# EAGLE design ProFinal (EAGLE 6.3)
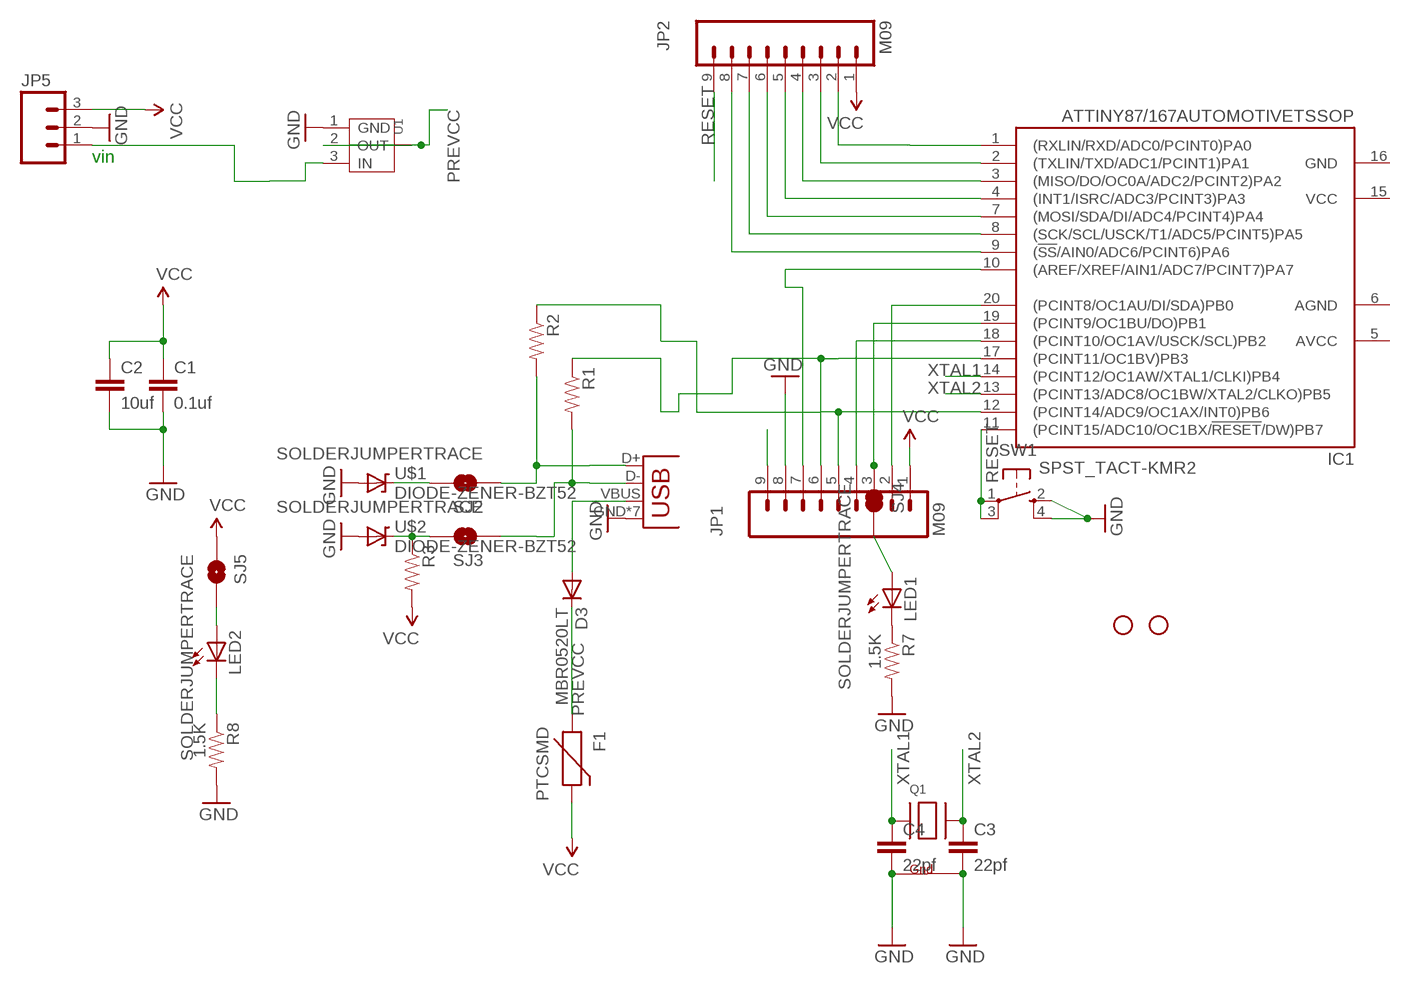
[diagram p0: schematic, sheet 1]

## Parts
C1  0.1uf  CAP0603-CAP  [0603-CAP]
C2  10uf  CAP0805  [0805]
C3  22pf  CAP0603-CAP  [0603-CAP]
C4  22pf  CAP0603-CAP  [0603-CAP]
D3  MBR0520LT  [SOD123]
F1  PTCSMD  [PTC-1206]
IC1  ATTINY87/167AUTOMOTIVETSSOP  [TSSOP20]
JP1  M09  [1X09]
JP2  M09  [1X09]
JP5  M03PTH  [1X03]
LED1  LEDCHIP-LED0805  [CHIP-LED0805]
LED2  LEDCHIP-LED0805  [CHIP-LED0805]
Q1  XTAL-4-3225  [NX3225]
R1  RESISTOR0603-RES  [0603-RES]
R2  RESISTOR0603-RES  [0603-RES]
R3  RESISTOR0603-RES  [0603-RES]
R7  1.5K  RESISTOR0603-RES  [0603-RES]
R8  1.5K  RESISTOR0603-RES  [0603-RES]
SJ2  SOLDERJUMPERTRACE  [SJ_2S-TRACE]
SJ3  SOLDERJUMPERTRACE  [SJ_2S-TRACE]
SJ4  SOLDERJUMPERTRACE  [SJ_2S-TRACE]
SJ5  SOLDERJUMPERTRACE  [SJ_2S-TRACE]
STANDOFF3  STAND-OFFTIGHT  [STAND-OFF-TIGHT]
STANDOFF4  STAND-OFFTIGHT  [STAND-OFF-TIGHT]
SW1  SPST_TACT-KMR2  [KMR2]
U1  LD1117SOT89  [SOT89]
U$1  DIODE-ZENER-BZT52  [SOD-323]
U$2  DIODE-ZENER-BZT52  [SOD-323]
X1  USB-MICROB  [USB-MICROB]

## Nets
GND [POWER]: C1.2 C2.2 C3.2 C4.2 JP1.8 JP5.2 Q1.2(G2) Q1.4(G1) R7.2 R8.2 SW1.2(S) SW1.4(S1) U1.1(GND) U$1.2(A) U$2.2(A) X1.GND X1.P1(GND) X1.P2(GND) X1.P3(GND) X1.P4(GND) X1.P5(GND) X1.P6(GND)
N$1: IC1.20((PCINT8/OC1AU/DI/SDA)PB0) JP1.2
N$2: IC1.12((PCINT14/ADC9/OC1AX/INT0)PB6) JP1.5 R2.1
N$3: IC1.19((PCINT9/OC1BU/DO)PB1) JP1.3 SJ4.1
N$4: IC1.1((RXLIN/RXD/ADC0/PCINT0)PA0) JP2.2
N$5: IC1.2((TXLIN/TXD/ADC1/PCINT1)PA1) JP2.3
N$6: IC1.3((MISO/DO/OC0A/ADC2/PCINT2)PA2) JP2.4
N$7: IC1.4((INT1/ISRC/ADC3/PCINT3)PA3) JP2.5
N$8: IC1.7((MOSI/SDA/DI/ADC4/PCINT4)PA4) JP2.6
N$10: IC1.18((PCINT10/OC1AV/USCK/SCL)PB2) JP1.4
N$12: R1.2 SJ3.1 X1.D-
N$13: R2.2 SJ2.1 X1.D+
N$14: IC1.8((SCK/SCL/USCK/T1/ADC5/PCINT5)PA5) JP2.7
N$15: IC1.9((!SS!/AIN0/ADC6/PCINT6)PA6) JP2.8
N$16: IC1.10((AREF/XREF/AIN1/ADC7/PCINT7)PA7) JP1.7
N$18: IC1.17((PCINT11/OC1BV)PB3) JP1.6 R1.1
N$19: SJ2.2 U$1.1(C)
N$20: R3.1 SJ3.2 U$2.1(C)
N$21: LED1.C R7.1
N$22: LED1.A SJ4.2
N$23: LED2.A SJ5.2
N$24: LED2.C R8.1
N$25 [POWER]: D3.A X1.VBUS
PREVCC [POWER]: D3.C F1.1 U1.2(OUT) U1.4(TAB)
RESET: IC1.11((PCINT15/ADC10/OC1BX/!RESET!/DW)PB7) JP2.9 SW1.1(P) SW1.3(P1)
VCC [POWER]: C1.1 C2.1 F1.2 JP1.1 JP2.1 JP5.3 R3.2 SJ5.1
VIN [POWER]: JP1.9 JP5.1 U1.3(IN)
XTAL1: C4.1 IC1.14((PCINT12/OC1AW/XTAL1/CLKI)PB4) Q1.1(X1)
XTAL2: C3.1 IC1.13((PCINT13/ADC8/OC1BW/XTAL2/CLKO)PB5) Q1.3(X2)
Unconnected: IC1.5(AVCC) IC1.6(AGND)

## Notes on the sheet
- vin

## Power pins joined to a net without a drawn wire
GND: IC1.16(GND)
VCC: IC1.15(VCC)

## Library data of the parts
C1-C4 = SparkFun:CAP: Capacitor Standard 0603 ceramic capacitor, and 0.1" leaded capacitor.
D3 = diode:MBR0520LT: SCHOTTKY BARRIER RECTIFIER Source: http://onsemi.com .. MBR0520LT1-D.pdf
F1 = SparkFun-PowerIC:PTC: Resettable Fuse PTC Resettable Fuse. Spark Fun Electronics SKU : COM-08357
IC1 = attiny87_167_automotive:ATTINY87/167AUTOMOTIVE
JP1 JP2 = SparkFun:M09: Header 9 Standard 9-pin 0.1" header. Use with straight break away headers (SKU : PRT-00116), right angle break away headers (PRT-00553), swiss pins (PRT-00743), machine pins (PRT-00117), and female headers (PRT-00115).
JP5 = SparkFun:M03: Header 3 Standard 3-pin 0.1" header. Use with straight break away headers (SKU : PRT-00116), right angle break away headers (PRT-00553), swiss pins (PRT-00743), machine pins (PRT-00117), and female headers (PRT-00115). Molex polarized connector foot print use with SKU : PRT-08232 with associated crimp pins and housings.
LED1 LED2 = adafruit:LED: LED OSRAM: - CHIPLED LG R971, LG N971, LY N971, LG Q971, LY Q971, LO R971, LY R971 LH N974, LH R974 LS Q976, LO Q976, LY Q976 LO Q996 - Hyper CHIPLED LW Q18S LB Q993, LB Q99A, LB R99A - SideLED LS A670, LO A670, LY A670, LG A670, LP A670 LB A673, LV A673, LT A673, LW A673 LH A674 LY A675 LS A676, LA A676, LO A676, LY A676, LW A676 LS A679, LY A679, LG A679 - Hyper Micro SIDELED® LS Y876, LA Y876, LO Y876, LY Y876 LT Y87S - SmartLED LW L88C, LW L88S LB L89C, LB L89S, LG L890 LS L89K, LO L89K, LY L89K LS L896, LA L896, LO L896, LY L896 - TOPLED LS T670, LO T670, LY T670, LG T670, LP T670 LSG T670, LSP T670, LSY T670, LOP T670, LYG T670 LG T671, LOG T671, LSG T671 LB T673, LV T673, LT T673, LW T673 LH T674 LS T676, LA T676, LO T676, LY T676, LB T676, LH T676, LSB T676, LW T676 LB T67C, LV T67C, LT T67C, LS T67K, LO T67K, LY T67K, LW E67C LS E67B, LA E67B, LO E67B, LY E67B, LB E67C, LV E67C, LT E67C LW T67C LS T679, LY T679, LG T679 LS T770, LO T770, LY T770, LG T770, LP T770 LB T773, LV T773, LT T773, LW T773 LH T774 LS E675, LA E675, LY E675, LS T675 LS T776, LA T776, LO T776, LY T776, LB T776 LHGB T686 LT T68C, LB T68C - Hyper Mini TOPLED® LB M676 - Mini TOPLED Santana® LG M470 LS M47K, LO M47K, LY M47K Source: http://www.osram.convergy.de/
Q1 = adafruit:XTAL-4: Classic 4-pin 3.2 x 2.5mm crystal
R1-R3 R7 R8 = SparkFun-Passives:RESISTOR: Resistor Basic schematic elements and footprints for 0603, 1206, and PTH resistors.
SJ2-SJ5 = SparkFun:SOLDERJUMPER: Solder Jumper Standard SMD solder jumper. Used to automate production. Two varients : Normally Open and Normally Closed are the same, but have different paste layers. NC will have a large amount of paste and should jumper during reflow.
STANDOFF3 STANDOFF4 = holes:STAND-OFF: #4 Stand Off This is the mechanical footprint for a #4 phillips button head screw. Use the keepout ring to avoid running the screw head into surrounding components. SKU : PRT-00447
SW1 = adafruit:SPST_TACT: SMT 6mm switch, EVQQ2 series http://www.ladyada.net/library/eagle
U1 = IC:LD1117
U$1 U$2 = SparkFun-DiscreteSemi:DIODE-ZENER: Zener Diode Production Part - 8199 3.4V Zener Voltage
X1 = embeddedmicro:USB: USB Connectors USB-B-PTH is fully proven SKU : PRT-00139/CONN-08278 USB-miniB is fully proven SKU : PRT-00587 USB-A-PCB is untested. USB-A-H is throughly reviewed, but untested. Spark Fun Electronics SKU : PRT-00437 USB-B-SMT is throughly reviewed, but untested. Needs silkscreen touching up. USB-A-S has not been used/tested USB-MB-H has not been used/tested USB-MICROB has been used. CONN-09505; PROD_ID: CONN-09505

## Net classes
1 POWER: width 0.203 mm

## Board
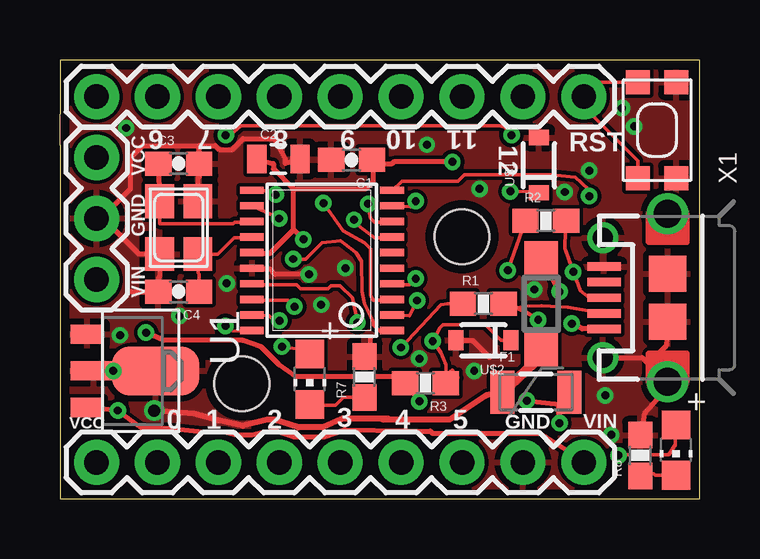
[diagram p1: board, top side]
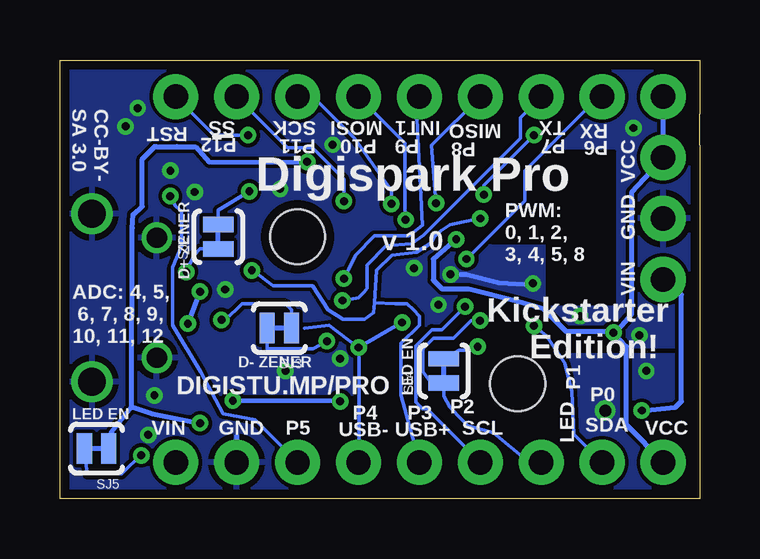
[diagram p2: board, bottom side, seen from below]

Size 26.67 x 18.29 mm. Coordinates in mm from the lower left corner, seen from the top.
Outline: 0,14.73 0,16.03 0,18.29 26.67,18.29 26.67,0 0,0 0,4.29 0,10.41 0,14.73
Copper layers (1*16): Top 0.0356mm / dielectric 1.5011mm / Bottom 0.0356mm
Design rules "LaenPCBOrder *": minimum track width 6mil, minimum drill 13mil, track to track 6mil, track to pad 6mil, pad to pad 6mil, via to via 6mil, smd to smd 6mil, copper to edge 15mil, drill to drill 6mil, minimum pad ring 7mil, minimum via ring 7mil, stop-mask expansion 4mil, vias tented up to drill 20mil, thermal gap 10mil
tRestrict: area 0.3,5.8 to 2,6.1
bRestrict: area 3.6,8.1 to 8.6,14.5

### Footprints (pad centres in the part's own frame; a part is rotated, then mirrored left to right if it is on the bottom)
0603-CAP = smd 1.1 x 1: 1 -0.85,0; 2 0.85,0
0805 = smd 0.8 x 1.2: 1 -0.9,0; 2 0.9,0
SOD123 = smd 1.4 x 1.4: A 1.9,0; C -1.9,0
PTC-1206 = smd 1 x 1.8: 1 -1.4,0; 2 1.4,0
TSSOP20 = smd 0.305 x 0.991: 1 -2.925,-2.918; 2 -2.275,-2.918; 3 -1.625,-2.918; 4 -0.975,-2.918; 5 -0.325,-2.918; 6 0.325,-2.918; 7 0.975,-2.918; 8 1.625,-2.918; 9 2.275,-2.918; 10 2.925,-2.918; 11 2.925,2.918; 12 2.275,2.918; 13 1.625,2.918; 14 0.975,2.918; 15 0.325,2.918; 16 -0.325,2.918; 17 -0.975,2.918; 18 -1.625,2.918; 19 -2.275,2.918; 20 -2.925,2.918
1X09 = drill 1.016 pad 1.88: 1 0,0; 2 2.54,0; 3 5.08,0; 4 7.62,0; 5 10.16,0; 6 12.7,0; 7 15.24,0; 8 17.78,0; 9 20.32,0
1X03 = drill 1.016 pad 1.88: 1 0,0; 2 2.54,0; 3 5.08,0
CHIP-LED0805 = smd 1.2 x 1.2: A 0,-1.05; C 0,1.05
NX3225 = smd 1.4 x 1.2: 1 -1.1,-0.8; 2 1.1,-0.8; 3 1.1,0.8; 4 -1.1,0.8
0603-RES = smd 1.1 x 1: 1 -0.85,0; 2 0.85,0
SJ_2S-TRACE = smd 0.635 x 1.27: 1 -0.508,0; 2 0.508,0
STAND-OFF-TIGHT = hole 2.286: 0,0
KMR2 = smd 1 x 1: 1 2,0.8; 2 2,-0.8; 3 -2,0.8; 4 -2,-0.8
SOT89 = smd 0.8 x 1.4: 1 -1.524,-1.905; 3 1.524,-1.905 | smd 0.8 x 1.9: 2 0,-1.651 | smd 2.032 x 3.65: 4 0,0.94
SOD-323 = smd 0.63 x 0.83: 1 -1.15,0; 2 1.15,0
USB-MICROB = smd 0.35 x 1.4: D+ 0,2.65; D- -0.65,2.65; GND 1.3,2.65; ID 0.65,2.65; VBUS -1.3,2.65 | smd 1.5 x 1.55: P1 -1,0; P2 1,0 | drill 1.15 pad 1.422: P3 -3.5,0; P4 3.5,0 | drill 0.85 pad 1.27: P5 -2.5,2.7; P6 2.5,2.7

### Placement (x,y rotation side)
C1  12.16,14.13 180 top
C2  9.11,14.16 0 top
C3  4.95,13.97 0 top
C4  4.95,8.64 180 top
D3  20.07,8.13 90 top
F1  19.84,4.45 0 top
IC1  10.92,9.94 90 top
JP1  1.52,1.52 0 top
JP2  1.52,16.76 0 top
JP5  1.52,9.14 90 top
LED1  10.41,4.98 180 top
LED2  25.69,2.03 180 top
Q1  4.95,11.3 90 top
R1  17.65,8.13 0 top
R2  20.26,11.59 0 top
R3  15.24,4.83 180 top
R7  12.7,5.08 90 top
R8  24.19,1.81 90 top
SJ2  20.07,10.92 90 bottom
SJ3  17.53,7.11 180 bottom
SJ4  10.67,5.33 90 bottom
SJ5  25.15,2.1 180 bottom
STANDOFF3  7.59,4.79 0 top
STANDOFF4  16.76,10.92 0 top
SW1  24.89,15.37 90 top
U1  3.05,5.33 270 top
U$1  19.97,13.91 90 top
U$2  17.65,6.6 180 top
X1  25.34,8.38 90 top

### Tracks (layer width: path | path; a pad name or v marks a point on that pad's centre or on a via)
GND  (via drill 0.33, 0.33 pad 0.69)
  Top 0.203: 5.8,14.72 6.48,14.72 6.64,14.56 7.17,14.56 7.63,15.02 8.94,15.02 9.39,14.19 9.39,13.97 C2.2 | v10.38,9.36 8.97,9.36 8.75,9.58 8.38,9.58 8,9.58 | 2.99,8.64 C4.2 4.1,9.2 4.15,9.25 Q1.4 3.3,10.2 1.76,11.74 | 1.76,11.74 2.95,12.92 2.95,14.22 3.45,14.72 5.8,14.72 | 17.92,5.88 17.2,6.6 16.63,6.6 U$2.2 | 24.52,5.63 25.27,4.88 25.27,4.58 24.38,3.56 24.26,2.76 R8.2 | 22.57,5.88 24.27,5.88 24.52,5.63 | 24.52,5.63 25.27,6.38 X1.P1 | 12.95,5.93 12.95,6.73 | JP5.2 1.71,11.68 1.76,11.74 | 5.8,14.72 C3.2 5.8,13.41 5.75,13.36 Q1.2
  Bottom 0.203: v10.38,9.36 9.73,9.36 8.36,9 6.96,8.92 | 19.3,2.61 JP1.8
  other vias: 17.27,5.33 10.89,8.09 11.9,9.61 6.95,8.98 2.51,6.82 2.76,15.46 21.05,12.79 22.73,4.32 22.06,13.68 4.98,7.61 14.99,5.84 22.99,2.67 17.49,12.92 19.78,8.72 15.3,14.76 23.43,16.28 23.94,15.52
  pour Top: -1.78,19.81 -1.78,6.35 7.75,6.35 7.75,6.1 9.02,4.83 8.26,3.81 8.26,-1.14 8.13,-1.27 28.96,-1.27 28.96,19.81
  pour Bottom: -1.78,19.3 -1.78,6.35 7.62,6.35 8.89,5.08 8.89,4.57 8.13,3.81 8.13,-1.27 28.96,-1.78 28.96,19.3
N$1  (via drill 0.33 pad 0.69)
  Top 0.152: v6.9,7.21 7.2,7.01 7.58,6.98 8,6.98
  Top 0.203: 8,6.98 IC1.20
  Bottom 0.152: JP1.2 5.23,2.69 5.33,4.47 5.63,5.65 6.39,6.81 v6.9,7.21
N$2  (via drill 0.33)
  Top 0.152: IC1.12 v9.14,11.68 | R2.1 v18.67,9.53
  Bottom 0.152: v9.14,11.68 10.41,11.43 10.79,11.18 11.05,10.92 11.18,10.67 11.81,10.29 12.83,10.16 13.46,9.53 13.56,8.17 | 13.56,8.17 13.59,7.75 13.97,7.49 14.35,7.49 14.48,7.49 14.86,7.49 15.49,7.87 16.13,8.89 17.78,8.89 18.63,9.53 v18.67,9.53 | JP1.5 12.45,4.32 12.45,6.48 11.68,7.24 11.68,7.62 11.94,7.87 12.19,8.13 12.7,8.13 13.56,8.17
N$3  (via drill 0.33 pad 0.69)
  Top 0.152: IC1.19 8.73,7.63 8.93,7.43 v9.15,7.43
  Bottom 0.152: JP1.3 7.12,1.52 8.61,2.76 9.65,3.05 9.91,3.3 10.41,3.81 10.67,4.28 10.67,4.43 SJ4.1 11.18,4.83 11.53,5.29 11.53,6.25 11.09,6.69 10.26,6.69 9.52,7.43 v9.15,7.43
N$4  (via drill 0.33 pad 0.69)
  Top 0.152: 13.84,6.98 13.52,6.98 13.34,6.98 13.08,7.24 13.08,7.37 12.95,7.62 12.83,7.87 12.7,8.13 12.6,8.66 12.57,9.91 12.35,10.26 12.22,10.36 11.7,10.76 10.92,10.67 10.25,10 v9.72,10
  Top 0.203: 13.84,6.98 IC1.1
  Bottom 0.152: JP2.2 4.21,16.76 7.29,13.68 7.29,12.43 v9.72,10
N$5  (via drill 0.33 pad 0.69)
  Top 0.152: v14.89,8.27 14.56,7.63 IC1.2
  Bottom 0.152: v14.89,8.27 14.22,8.38 13.97,8.64 13.88,8.77 13.88,9.74 13.08,10.54 12.02,10.63 11.51,10.99 7.48,15.02 7.48,15.89 JP2.3
N$6  (via drill 0.33 pad 0.69)
  Top 0.152: v10.98,12.33 11.3,11.87 11.81,11.18 12.7,10.67 12.95,10.41 12.95,9.4 12.95,8.51 13.05,8.28 13.12,8.28 13.72,8.28 13.84,8.28
  Top 0.203: IC1.3 13.72,8.28
  Bottom 0.152: JP2.4 11.18,14.73 v10.98,12.33
N$7  (via drill 0.33 pad 0.69)
  Top 0.152: v14.83,9.18 14.81,9.18 14.56,8.93 13.84,8.93
  Top 0.203: IC1.4 13.84,8.93
  Bottom 0.152: v14.83,9.18 14.35,10.16 13.56,10.96 12.13,10.96 11.56,11.39 11.82,16.63 JP2.5
N$8  (via drill 0.33 pad 0.69)
  Top 0.152: v12.26,11.63 12.53,11.31 13.12,10.88 13.46,10.88 13.84,10.88
  Top 0.203: IC1.7 13.46,10.88
  Bottom 0.152: JP2.6 12.28,14.82 12.28,12 v12.26,11.63
N$10  (via drill 0.33 pad 0.69)
  Top 0.152: 8,8.28 9.51,8.28 v9.78,8.01
  Top 0.203: 8,8.28 IC1.18
  Bottom 0.152: v9.78,8.01 10.73,7.05 11.17,7.05 11.84,6.38 11.84,4.04 11.55,3.75 11.37,3.75 JP1.4
N$12  (via drill 0.33)
  Top 0.152: 18.63,8.13 18.76,7.91 19.41,8.02 20.07,8.05 21.19,7.99 22.62,7.73 | v19.94,7.46 19.46,7.78 R1.2
  Top 0.203: 18.63,8.13 R1.2 | X1.D- 22.62,7.73
  Bottom 0.152: SJ3.1 17.02,7.87 17.27,8.13 R1.2 19.08,8.13 19.26,7.95 19.61,7.64 v19.94,7.46
N$13  (via drill 0.33)
  Top 0.152: 22.62,8.38 22.07,8.38 21.69,8.66 21.05,10.45 | 21.05,10.45 21.08,11.18 R2.2 | 21.05,10.45 21.24,9.91 v21.4,9.46
  Top 0.203: X1.D+ 22.62,8.38
  Bottom 0.152: v21.4,9.46 21.08,10.16 20.83,10.41 SJ2.1
N$14  (via drill 0.33 pad 0.69)
  Top 0.152: v12.85,12.29 12.95,11.68 13.11,11.53 13.84,11.53
  Top 0.203: 13.84,11.53 IC1.8
  Bottom 0.152: JP2.7 16,16.64 14.38,15.02 12.85,12.85 v12.85,12.29
N$15  (via drill 0.33 pad 0.69)
  Top 0.152: v14.84,12.41 14.61,12.18 IC1.9
  Bottom 0.152: JP2.8 17.17,14.63 16.14,14.63 14.84,13.32 v14.84,12.41
N$16  (via drill 0.33 pad 0.69)
  Top 0.152: v22.07,12.62 v22.07,12.61 22.01,12.93 21.5,13.4 20.49,13.52 16.87,13.52 16.59,13.24 14.25,13.24 13.84,12.83
  Top 0.203: 13.84,12.83 IC1.10
  Bottom 0.152: JP1.7 18.54,3.3 19.88,3.56 20.8,5.31 21.97,7.24 21.97,9.65 21.59,10.54 21.59,11.47 21.59,11.98 21.84,12.19 v22.07,12.62
N$18  (via drill 0.33 pad 0.69)
  Top 0.152: 8,8.93 8.73,8.93 9.81,8.93 9.87,8.93 10.03,8.76 10.92,8.76 11.18,8.76 11.3,8.89 11.68,8.89 12.19,8.38 v12.41,7.35 | v14.22,6.31 15.88,8.09 16.15,8.13 16.76,8.13 R1.1 16.93,8.13
  Top 0.203: IC1.17 8,8.93 | R1.1 16.76,8.13
  Bottom 0.152: 14.2,6.32 14.2,1.5 JP1.6 | 14.2,6.32 v12.41,7.35 | 14.22,6.28 | 14.22,6.28 14.22,6.32 14.26,6.32 14.34,6.4 v14.22,6.31 15.46,7.23 16.47,7.11 | 14.22,6.28 14.2,6.32
N$19  (via drill 0.33 pad 0.69)
  Top 0.152: v18.77,12.82 20.06,12.8 20.06,12.69 20.07,12.69 U$1.1
  Bottom 0.152: v18.77,12.82 20.07,12.03 SJ2.2
N$20  (via drill 0.33 pad 0.69)
  Top 0.152: 15.58,6.58 15.88,6.1 16.09,5.58 16.11,5.05 16.6,5.05 16.34,5.33 | 15.58,6.58 15.83,7.11 15.97,7.25 17.74,7.25 18.39,6.6 U$2.1 18.93,6.6 | 15.58,6.58 v15.54,6.58
  Top 0.203: U$2.1 | R3.1 16.34,5.33
  Bottom 0.152: v15.54,6.58 16.12,6.25 18.03,6.25 SJ3.2
N$21
  Top 0.152: 10.67,3.9 11.5,3.9 11.82,4.23 12.22,4.23 12.95,4.23
  Top 0.203: R7.1 12.95,4.23 | 10.67,3.9 LED1.C
N$22  (via drill 0.33 pad 0.69)
  Top 0.152: v9.25,6.35 9.84,6.27 10.6,6.13 10.67,6
  Top 0.203: 10.67,6 LED1.A
  Bottom 0.152: v9.25,6.35 9.4,6.2 10.03,6.2 SJ4.2
N$23  (via drill 0.33 pad 0.69)
  Top 0.152: v23.28,1.82 23.66,1.85 25.38,1.85 25.65,2.25 LED2.A 25.65,3.08
  Top 0.203: LED2.A 25.65,3.08
  Bottom 0.152: v23.28,1.82 23.25,1.89 24.1,1.04 25.53,1.04 SJ5.2
N$24
  Top 0.152: 25.65,0.98 24.82,0.98 24.75,1.06 24.64,1.06 24.26,1.06
  Top 0.203: R8.1 24.64,1.06 | 25.65,0.98 LED2.C
N$25  (via drill 0.33)
  Top 0.203: X1.VBUS 21.78,7.08 v21.34,7.3 | v20.83,8.64 D3.A
  Bottom 0.203: v21.34,7.3 v20.83,8.64
PREVCC  (via drill 0.33, 0.5)
  Top 0.254: F1.1 17.78,4.32 16.26,3.3 13.46,3.3 13.72,3.33 11.75,3.33 10.95,2.98 9.94,2.98 8.95,3.3 8.64,3.3 7.62,3.05 6.6,3.27 5.59,3.56 v3.94,3.68
  Top 0.406: U1.2 0.8,5.33 | D3.C 20.07,5.97 F1.1
  other vias: 2.22,5.33
  pour Top: 0.51,5.84 6.1,5.72 7.87,5.33 7.87,0 0,0 0,5.33
  pour Bottom: 0,5.97 5.59,5.97 7.87,5.33 7.87,0 0,0
RESET  (via drill 0.33 pad 0.69)
  Top 0.152: v18.83,15.16 18.54,15.49 18.35,15.56 7.56,15.56 7.09,15.16 v6.91,15.16 | v9,12.68 8.88,12.68 8.73,12.83 8,12.83 | SW1.3 24.09,14.1 21.84,16.34 JP2.9 22.45,17.37 SW1.1
  Top 0.203: IC1.11 8,12.83 | SW1.3 | SW1.1
  Bottom 0.152: v9,12.68 9,13.07 v6.91,15.16 | JP2.9 20.24,15.16 v18.83,15.16
VCC  (via drill 0.33, 0.33 pad 0.69)
  Top 0.203: 9.74,12.93 12.76,12.93 13.04,13.22 13.04,13.97 | 9.74,12.93 9.72,12.93 8.9,13.76 8.9,13.97 C2.1 | 9.74,11.22 9.74,12.93 | 9.74,11.22 8.75,10.23 8,10.23 IC1.15 | v10.15,10.82 10.02,10.94 9.74,11.22 | v20.83,3.16 20.84,3.19 20.83,3.11 | v16.36,14.04 13.92,14.04 13.85,13.97 13.04,13.97 | C1.1 13.04,13.97 | R3.2 v14.99,4.06 | v19.46,4.1 20.83,3.93 | 14.22,5.08 9.84,5.08 9.14,5.59 8.64,6.1 8.38,6.35 7.62,6.6 4.32,6.6 v3.59,6.93
  Top 0.254: 20.83,3.11 20.83,3.93 F1.2
  Bottom 0.203: v10.15,10.82 11.11,9.99 11.11,9.11 10.74,8.75 9.63,8.75 7.63,8.25 6.54,7.94 5.6,7 5.6,6.99 3.4,6.99 3.51,6.89 | JP1.1 3.05,3.1 3.05,6.35 v3.59,6.93 | 3.56,6.89 2.85,7.7 2.85,12.78 JP5.3 1.52,14.35 JP2.1 | 3.56,6.89 3.51,6.89 | 3.51,6.89 v3.59,6.93 | 23.69,3.84 23.66,11.28 23.62,11.84 23.24,12.19 23.24,14.16 22.72,14.68 22.64,14.68 21.79,14.68 21.02,14.67 20.45,14.03 v16.36,14.04 | 23.69,3.84 24.51,2.79 SJ5.1 | 23.69,3.84 22.81,3.54 v20.83,3.16 | 3.51,6.89 v3.59,6.93 | v14.99,4.06 v19.46,4.1 | 3.56,6.89 3.56,6.86
VIN  (via drill 0.33)
  Top 0.203: JP1.9 21.69,1.67 20,2.73 15.54,2.73 15.45,2.83 14.49,2.83 14.47,2.84 11.88,2.89 11.03,2.58 10.99,2.58 9.75,2.59 8.95,2.86 8.64,2.79 8.51,2.79 8,2.67 7.37,2.67 6.86,2.79 5.97,2.79 4.57,2.94 3.57,2.94 3.41,2.94 v2.41,3.68 U1.3
  Top 0.406: 0.83,3.69 1.14,3.69 U1.3
  Bottom 0.203: v2.41,3.68 1.02,3.81 0.76,4.06 0.76,8.51 JP5.1
XTAL1
  Top 0.152: 8,10.88 7.26,10.88 6.58,10.2 Q1.1 5.75,9.42 5.8,9.37 C4.1
  Top 0.203: 8,10.88 IC1.14 | C4.1
XTAL2
  Top 0.152: 8,11.53 7.28,11.53 7.22,11.47 4.15,11.47 Q1.3 4.15,12.87 4.15,13.33 4.1,13.38 C3.1
  Top 0.203: IC1.13 8,11.53 | C3.1 Q1.3

### Text on the board
tPlace: 6 | 7 | 8 | 9 | 10 | 11 | 12 | RST | VCC | GND | VIN | 3 | VIN | VCC | 0 | 1 | 2 | 4 | 5 | GND
bPlace: RX | TX | MISO | INT1 | MOSI | SCK | SS | RST | CC-BY- / SA 3.0 | VCC | P6 | P7 | P8 | P9 | P10 | P11 | P12 | Digispark Pro | GND | D+ ZENER | v 1.0 | VIN | PWM: / 0, 1, 2, / 3, 4, 5, 8 | Kickstarter | P1 | Edition! | D- ZENER | ADC: 4, 5, / 6, 7, 8, 9, / 10, 11, 12 | P0 | LED | P2 | LED EN | DIGISTU.MP/PRO | VCC | SDA | SCL | P3 | USB+ | P4 | USB- | P5 | GND | VIN | LED EN